# Altium schematic sheet low-pass-filter.SchDoc
size A4; SheetNumber: 3; SheetTotal: 6
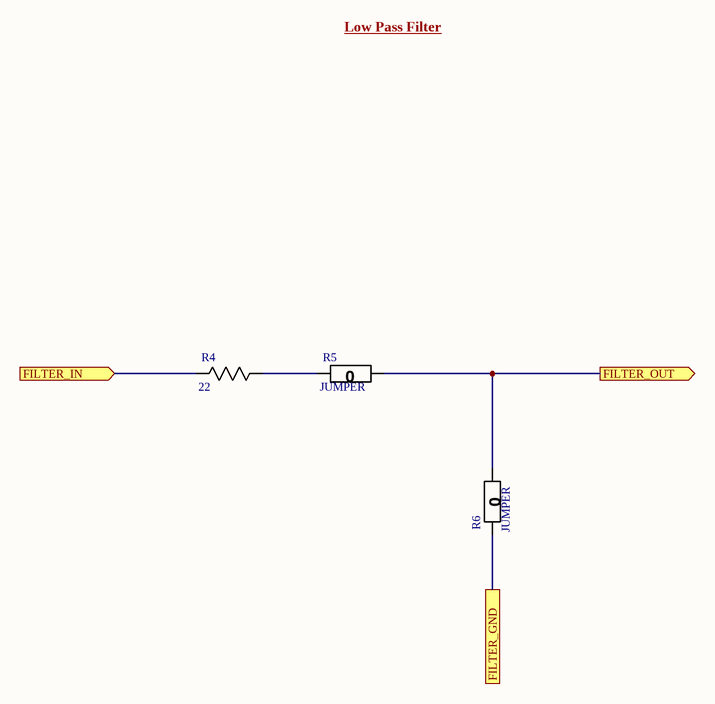
[diagram p0: low-pass-filter.SchDoc]

## Parts
R4  22  [0805]
R5  JUMPER  [0805]
R6  JUMPER  [0805]

## Ports
FILTER_GND, FILTER_IN (in), FILTER_OUT (out)

## Nets
FILTER_GND: R6.2(R2) ; port FILTER_GND
FILTER_IN: R4.2(R2) ; port FILTER_IN
FILTER_OUT: R5.1(R1) R6.1(R1) ; port FILTER_OUT
NetR4_1: R4.1(R1) R5.2(R2)

## Notes on the sheet
- Low Pass Filter

## Library data of the parts
R4 = RES 22.0 1/8W: RES SMD 22 OHM 5% 1/8W 0805; Power (Watts): 0.125W; Package: 0805; Value: 22; Tolerance: 5%
R5 R6 = RES 0 JUMPER: RES SMD 0 OHM JUMPER GENERIC 0805; Value: 0; Package: 0805